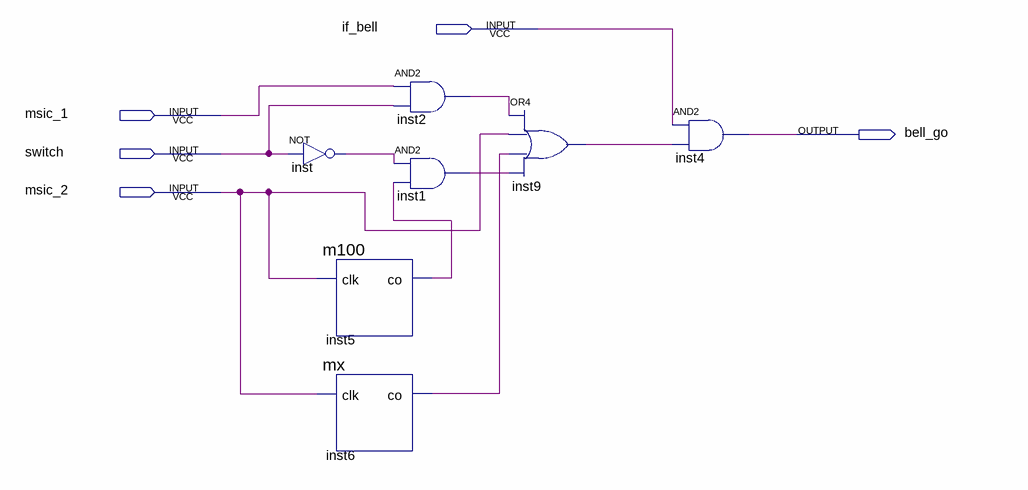
[diagram p0: schematic sheet]
// Quartus schematic bell_music.bdf as structural Verilog: 7 symbols, 5 pins
module bell_music (
  input  if_bell,
  input  msic_1,
  input  switch,
  input  msic_2,
  output bell_go
);

  wire inst1_out, inst2_out, inst5_co, inst6_co, inst9_out, inst_out;

  not inst (inst_out, switch);
  m100 inst5 (.clk(msic_2), .co(inst5_co));
  mx inst6 (.clk(msic_2), .co(inst6_co));
  and inst2 (inst2_out, msic_1, switch);
  and inst1 (inst1_out, inst_out, inst5_co);
  or inst9 (inst9_out, inst2_out, msic_2, inst6_co, inst1_out);
  and inst4 (bell_go, if_bell, inst9_out);
endmodule
